# EasyEDA schematic Test01.json
TITLE: Sheet_1; REV: 1.0; Date: 2020-08-19; Sheet: 1/1; Company: Your Company
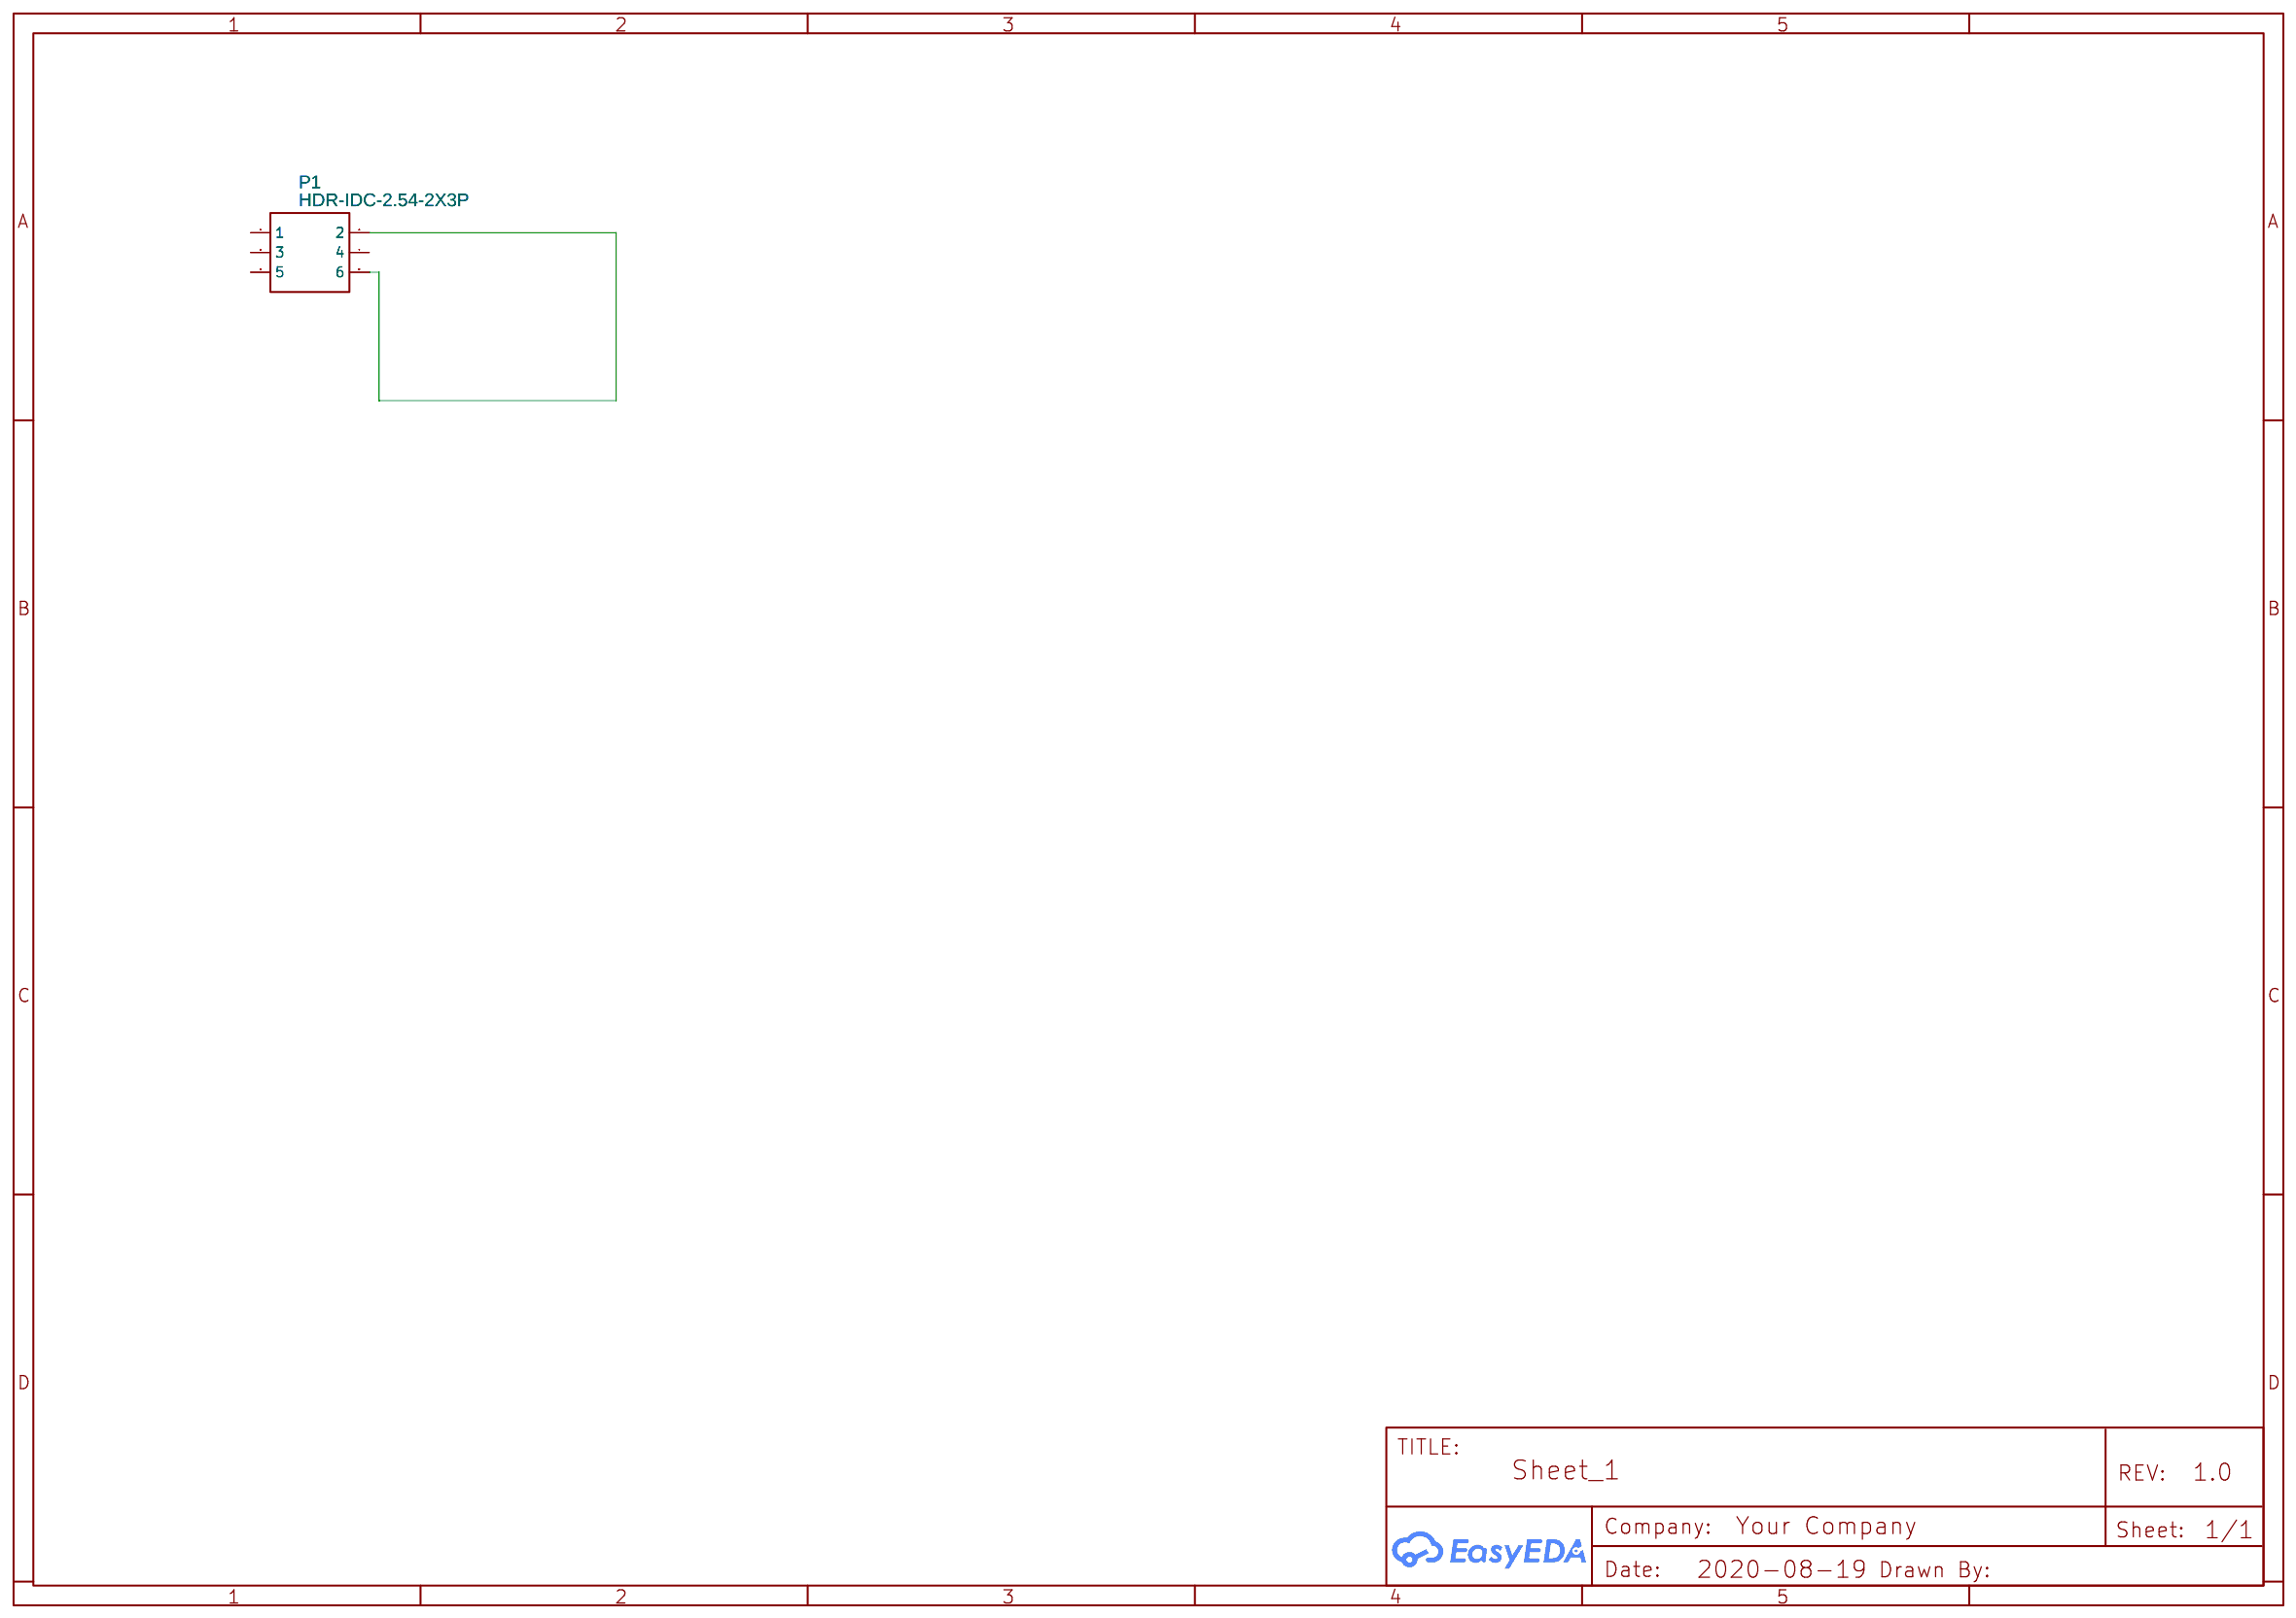
[diagram p0: schematic sheet]

## Parts
P1  HDR-IDC-2.54-2X3P  [IDC-TH_6P-P2.54_C11214]

## Library data of the parts
P1 = HDR-IDC-2.54-2X3P: Supplier: LCSC; Manufacturer: BOOMELE; Manufacturer Part: 2X3 2.54mm IDC Box; image: //image.lceda.cn/szlcsc/C11214.jpg; Supplier Part: C11214

## Nets
Net-(P1-2): P1.2 P1.6

Not connected (* = marked no-connect by the designer): P1 1 3 4 5
